# Altium schematic sheet TTAmp_1T3K_amp_thermocouple.SchDoc
size A4; ApprovedBy: Krzysztof Belewicz; CheckedBy: Krzysztof Belewicz; Author: Krzysztof Belewicz; CompanyName: Koło Naukowe Systemów Scalonych; DrawnBy: Krzysztof Belewicz; Organization: KNSS; Address1: Koło Naukowe; Address2: Systemów Scalonych; Address3: 00-665 Warszawa; Address4: Nowowiejska 15/19; Revision: 0.1; SheetNumber: 1; SheetTotal: 2
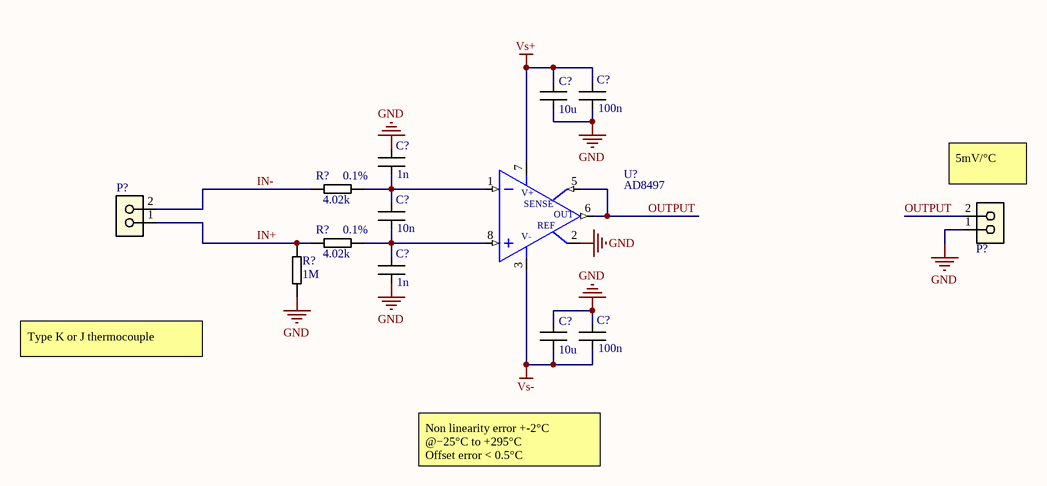
[diagram p0: TTAmp_1T3K_amp_thermocouple.SchDoc]

## Parts
(Parts that share a designator on the sheet are numbered #1, #2 ... from top to bottom, then left to right.)
C?#1  value 10u  [CAPC1608N]  (hidden comment: Capacitor)
C?#2  value 100n  [CAPC1608N]  (hidden comment: Capacitor)
C?#3  value 1n  [CAPC1608N]  (hidden comment: Capacitor)
C?#4  value 10n  [CAPC1608N]  (hidden comment: Capacitor)
C?#5  value 1n  [CAPC1608N]  (hidden comment: Capacitor)
C?#6  value 10u  [CAPC1608N]  (hidden comment: Capacitor)
C?#7  value 100n  [CAPC1608N]  (hidden comment: Capacitor)
P?#1  AK100/2DS-5,0-V/GRAU  [AK100/2DS-5,0-V/GRAU]  (value not drawn)
P?#2  AK100/2DS-5,0-V/GRAU  [AK100/2DS-5,0-V/GRAU]  (value not drawn)
R?#1  value 4.02k  Tolerance: 0.1%  [RESC1608N]  (hidden comment: Resistor)
R?#2  value 4.02k  Tolerance: 0.1%  [RESC1608N]  (hidden comment: Resistor)
R?#3  value 1M  [RESC1608N]  (hidden comment: Resistor)
U?  AD8497  [MSOP-8_N]

## Nets
GND: C?#1.1 C?#2.1 C?#3.2 C?#5.1 C?#6.2 C?#7.2 P?#2.1 R?#3.2 U?.2(REF)
Vs+: C?#1.2 C?#2.2 U?.7(+VS)
Vs-: C?#6.1 C?#7.1 U?.3(-VS)
IN+: P?#1.1 R?#2.2 R?#3.1
IN-: P?#1.2 R?#1.2
OUTPUT: P?#2.2 U?.5(SENSE) U?.6(REF)
NetC?#3_1: C?#3.1 C?#4.2 R?#1.1 U?.1(-IN)
NetC?#4_1: C?#4.1 C?#5.2 R?#2.1 U?.8(+IN)

## Notes on the sheet
- (near P?#2) 5mV/°C
- Type K or J thermocouple
- Non linearity error +-2°C @−25°C to +295°C
  Offset error < 0.5°C
- Project:
- Variant:
- File:
- Sheet:
- Revision:
- Total Sheet:
- Author:
- Modified:
- (in symbol AD8497) V+; OUT; V-

## Library data of the parts
C?#1 C?#6 = Capacitor: Tolerance: 20%; MaxVoltage: 50V; Supplier 1: TME; Supplier 2: *; Supplier Part Number 1: GRM188R60J106ME47D
C?#2-C?#5 C?#7 = Capacitor: MaxVoltage: 50V; Tolerance: *; Supplier 1: TME; Supplier 2: *
  C?#2 C?#7: Supplier Part Number 1: C0603C104K3RAC
P?#1 P?#2 = AK100/2DS-5,0-V/GRAU: Listwa zaciskowa do druku; kątowe 90°; 5mm; tory:2; na PCB; 24A; Manufacturer: PTR MESSTECHNIK; Supplier Part Number 1: AK100/2DS-5,0-V/GRAU; Manufacturer Part Number: AK100/2DS-5,0-V/GRAU; Supplier 1: TME
R?#3 = Resistor: Tolerance: 1%; Power: *; Supplier 1: TME; Supplier 2: *; Supplier Part Number 1: SMD0603-1M
U? = AD8497: Precision Thermocouple Amplifier with Cold Junction Compensation; Manufacturer Part Number 1: AD8497ARMZ; Manufacturer 1: ANALOG DEVICES; PackageReference 1: MSOP-8; ComponentLink1Description: Manufacturer Link; ComponentLink1URL: http://www.analog.com/en/prod/0%2C2877%2CAD622%2C00.html; ComponentLink2Description: Datasheet; ComponentLink2URL: http://www.analog.com/UploadedFiles/Data_Sheets/218546992AD622_c.pdf; Supplier 2: RS-ONLINE; Supplier Part Number 2: AD8497ARMZ; Supplier 1: Mouser; Supplier Part Number 1: 584-AD8497ARMZ-R7
R?#1 R?#2 = Resistor: Power: *; Supplier 1: TME; Supplier 2: *; Supplier Part Number 1: SMD0603-100R